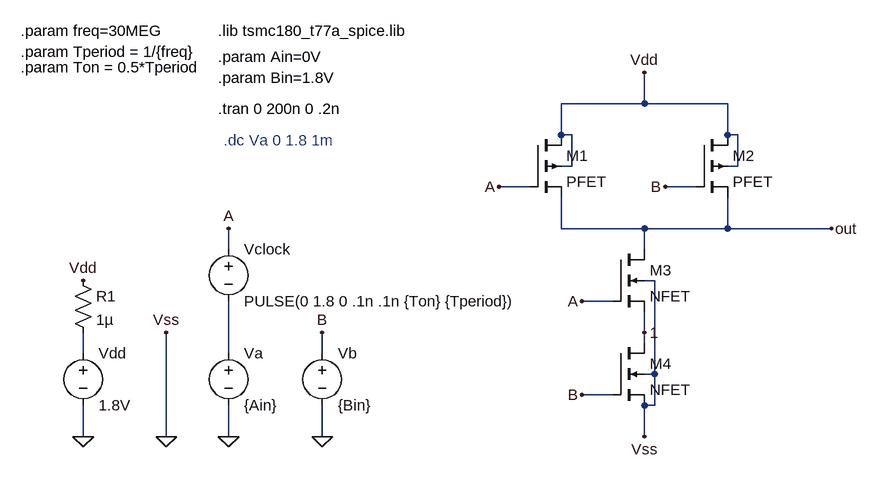
[diagram p0: schematic nand_gate.asc]
nand_gate.asc, the LTspice schematic file:
Version 4.1
SHEET 1 1636 1636
WIRE 800 -112 800 -160
WIRE 800 -112 672 -112
WIRE 928 -112 800 -112
WIRE 672 -64 672 -112
WIRE 688 -64 672 -64
WIRE 928 -64 928 -112
WIRE 944 -64 928 -64
WIRE 688 -16 688 -64
WIRE 688 -16 672 -16
WIRE 944 -16 944 -64
WIRE 944 -16 928 -16
WIRE 624 16 576 16
WIRE 880 16 832 16
WIRE 672 80 672 32
WIRE 800 80 672 80
WIRE 928 80 928 32
WIRE 928 80 800 80
WIRE 1088 80 928 80
WIRE 160 112 160 80
WIRE 800 112 800 80
WIRE 816 160 800 160
WIRE 752 192 704 192
WIRE 800 240 800 208
WIRE 800 256 800 240
WIRE -64 272 -64 240
WIRE 160 272 160 192
WIRE 304 272 304 240
WIRE 816 304 816 160
WIRE 816 304 800 304
WIRE 752 336 704 336
WIRE 816 352 816 304
WIRE 816 352 800 352
WIRE -64 400 -64 352
WIRE 64 400 64 240
WIRE 160 400 160 352
WIRE 304 400 304 352
WIRE 800 400 800 352
FLAG 800 -160 Vdd
FLAG 1088 80 out
FLAG 800 400 Vss
FLAG 576 16 A
FLAG 704 192 A
FLAG 704 336 B
FLAG 832 16 B
FLAG -64 160 Vdd
FLAG -64 400 0
FLAG 64 400 0
FLAG 64 240 Vss
FLAG 160 400 0
FLAG 304 240 B
FLAG 304 400 0
FLAG 160 80 A
FLAG 800 240 1
SYMBOL pmos4 624 -64 R0
SYMATTR InstName M1
SYMATTR Value PFET
SYMATTR Value2 l=.2u w=.8u
SYMBOL nmos4 752 112 R0
SYMATTR InstName M3
SYMATTR Value NFET
SYMATTR Value2 l=.2u w=.4u
SYMBOL pmos4 880 -64 R0
SYMATTR InstName M2
SYMATTR Value PFET
SYMATTR Value2 l=.2u w=.8u
SYMBOL nmos4 752 256 R0
SYMATTR InstName M4
SYMATTR Value NFET
SYMATTR Value2 l=.2u w=.4u
SYMBOL voltage -64 256 R0
WINDOW 123 0 0 Left 0
WINDOW 39 0 0 Left 0
SYMATTR InstName Vdd
SYMATTR Value 1.8V
SYMBOL voltage 160 256 R0
WINDOW 123 0 0 Left 0
WINDOW 39 0 0 Left 0
SYMATTR InstName Va
SYMATTR Value {Ain}
SYMBOL voltage 304 256 R0
WINDOW 123 0 0 Left 0
WINDOW 39 0 0 Left 0
SYMATTR InstName Vb
SYMATTR Value {Bin}
SYMBOL voltage 160 96 R0
WINDOW 123 0 0 Left 0
WINDOW 39 0 0 Left 0
SYMATTR InstName Vclock
SYMATTR Value PULSE(0 1.8 0 .1n .1n {Ton} {Tperiod})
SYMBOL res -80 144 R0
SYMATTR InstName R1
SYMATTR Value 1µ
TEXT 144 -224 Left 2 !.lib tsmc180_t77a_spice.lib
TEXT 144 -184 Left 2 !.param Ain=0V
TEXT 144 -152 Left 2 !.param Bin=1.8V
TEXT 144 -104 Left 2 !.tran 0 200n 0 .2n
TEXT 152 -56 Left 2 ;.dc Va 0 1.8 1m
TEXT -160 -224 Left 2 !.param freq=30MEG
TEXT -160 -192 Left 2 !.param Tperiod = 1/{freq}
TEXT -160 -168 Left 2 !.param Ton = 0.5*Tperiod

The netlist it stands for:
* nand_gate.asc
M1 Vdd A out Vdd PFET l=.2u w=.8u
M3 out A 1 0 NFET l=.2u w=.4u
M2 Vdd B out Vdd PFET l=.2u w=.8u
M4 1 B 0 0 NFET l=.2u w=.4u
Vdd N001 0 1.8V
Va N002 0 {Ain}
Vb B 0 {Bin}
Vclock A N002 PULSE(0 1.8 0 .1n .1n {Ton} {Tperiod})
R1 Vdd N001 1µ
.model NMOS NMOS
.model PMOS PMOS
.lib standard.mos
.lib tsmc180_t77a_spice.lib
.param Ain=0V
.param Bin=1.8V
.tran 0 200n 0 .2n
* .dc Va 0 1.8 1m
.param freq=30MEG
.param Tperiod = 1/{freq}
.param Ton = 0.5*Tperiod
.backanno
.end